# Altium project Eight_bit_v1.PrjPcb
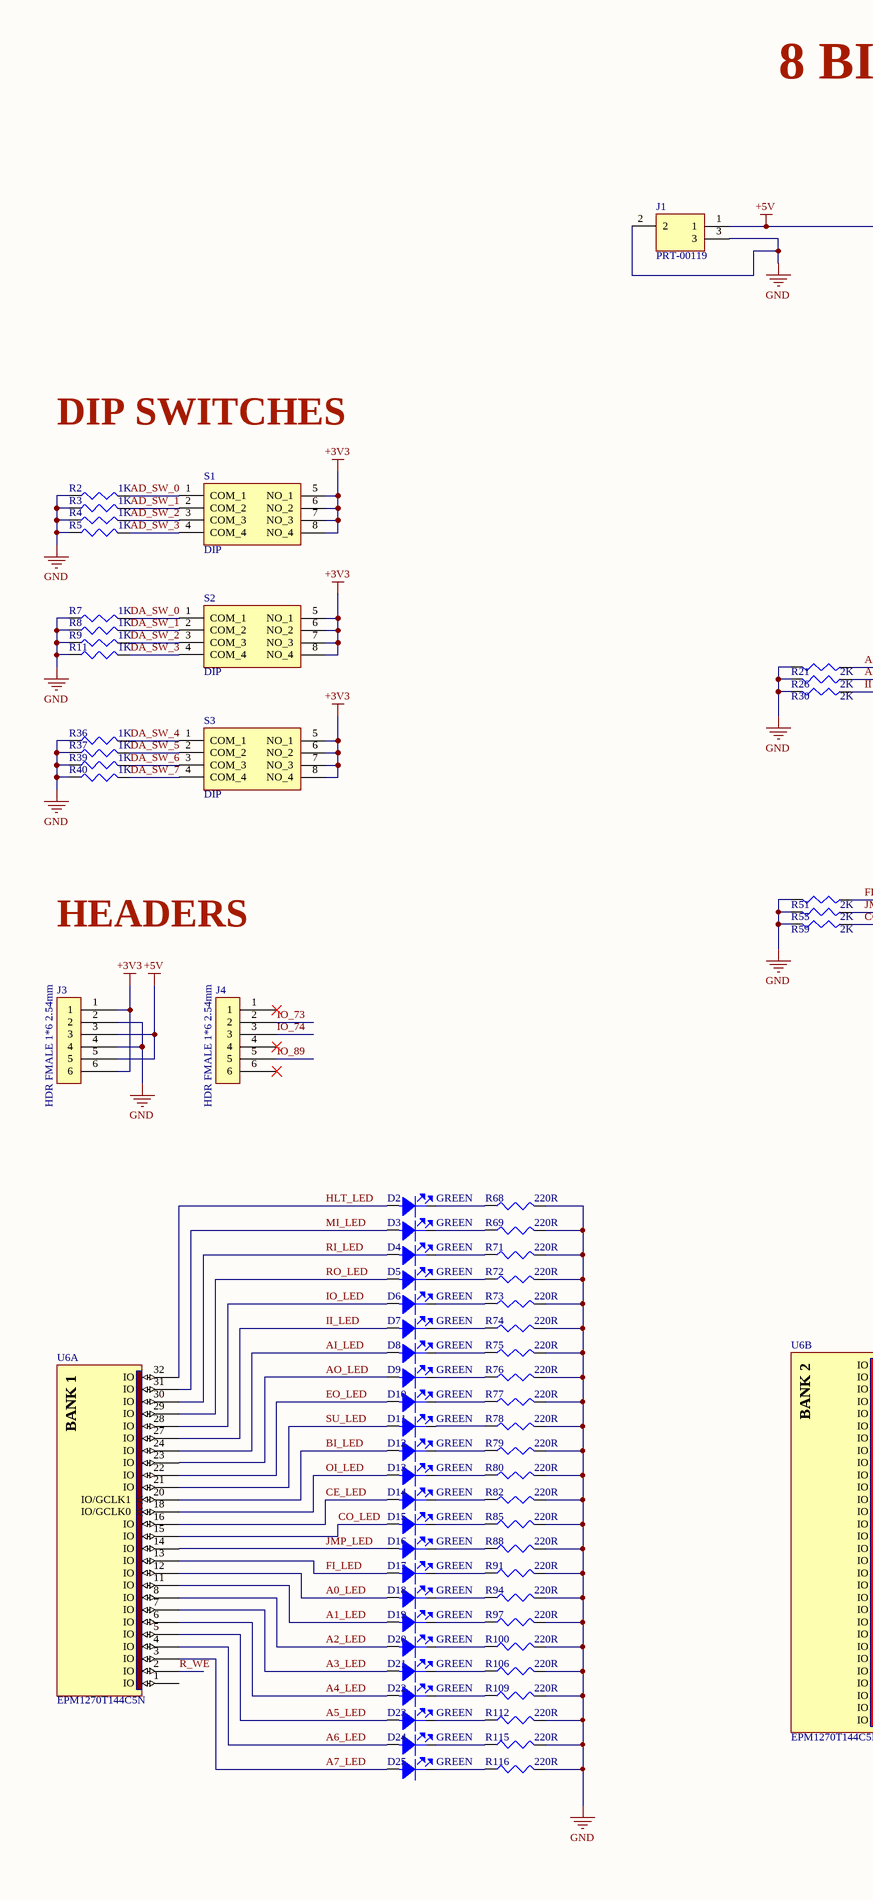
[diagram p0: Eight_bit_v1.SchDoc, left]
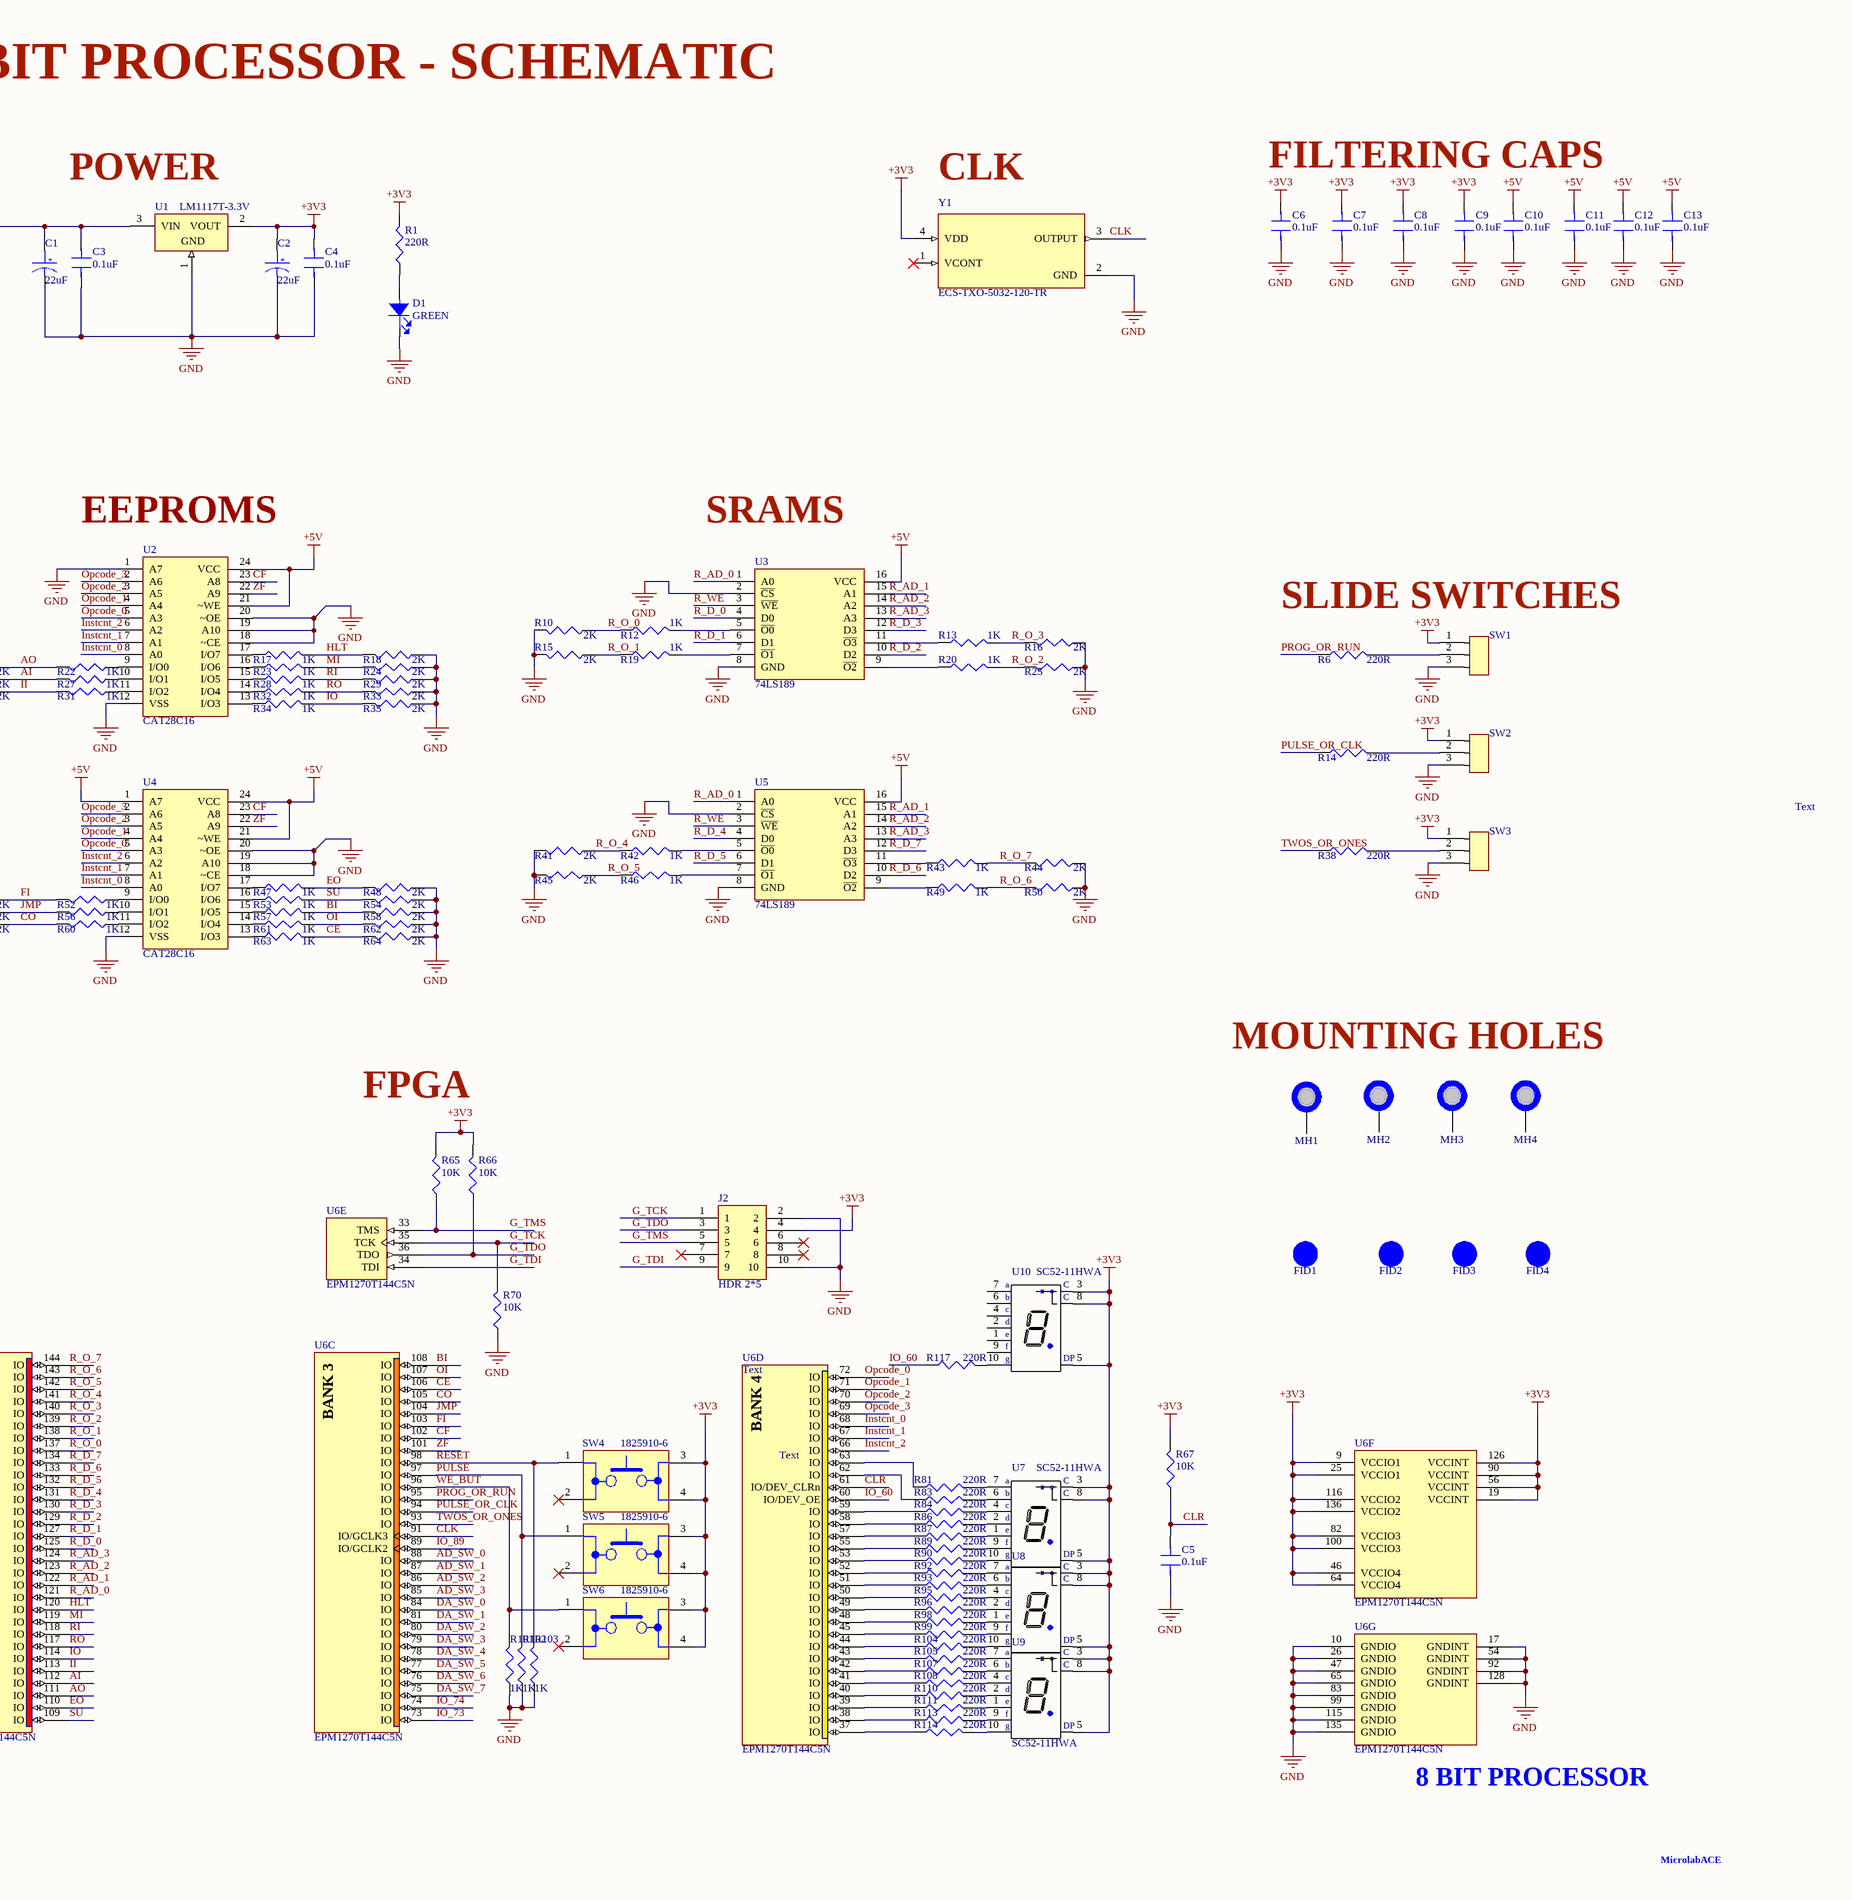
[diagram p1: Eight_bit_v1.SchDoc, right]
1 sheet, 187 parts. Net scope: global (net labels, ports and power ports of the same name join across sheets).
Board file: Eight_bit_v1.PcbDoc

## Sheet Eight_bit_v1.SchDoc
size A2

### Parts
C1  22uF  [CAPPRD200W50D550H1250]
C2  22uF  [CAPPRD200W50D550H1250]
C3  0.1uF  [C0805]
C4  0.1uF  [C0805]
C5  0.1uF  [C0805]
C6  0.1uF  [C0805]
C7  0.1uF  [C0805]
C8  0.1uF  [C0805]
C9  0.1uF  [C0805]
C10  0.1uF  [C0805]
C11  0.1uF  [C0805]
C12  0.1uF  [C0805]
C13  0.1uF  [C0805]
D1  GREEN  [LED_0805]
D2  GREEN  [LED_0805]
D3  GREEN  [LED_0805]
D4  GREEN  [LED_0805]
D5  GREEN  [LED_0805]
D6  GREEN  [LED_0805]
D7  GREEN  [LED_0805]
D8  GREEN  [LED_0805]
D9  GREEN  [LED_0805]
D10  GREEN  [LED_0805]
D11  GREEN  [LED_0805]
D12  GREEN  [LED_0805]
D13  GREEN  [LED_0805]
D14  GREEN  [LED_0805]
D15  GREEN  [LED_0805]
D16  GREEN  [LED_0805]
D17  GREEN  [LED_0805]
D18  GREEN  [LED_0805]
D19  GREEN  [LED_0805]
D20  GREEN  [LED_0805]
D21  GREEN  [LED_0805]
D22  GREEN  [LED_0805]
D23  GREEN  [LED_0805]
D24  GREEN  [LED_0805]
D25  GREEN  [LED_0805]
FID1  FID_1MMC  [FID_40x120D]  (value not drawn)  (no BOM)
FID2  FID_1MMC  [FID_40x120D]  (value not drawn)  (no BOM)
FID3  FID_1MMC  [FID_40x120D]  (value not drawn)  (no BOM)
FID4  FID_1MMC  [FID_40x120D]  (value not drawn)  (no BOM)
J1  PRT-00119  [PRT00119]
J2  HDR 2*5  [HDR_2X5_2.54MM]
J3  HDR FMALE 1*6 2.54mm  [Hdr_Female_1*6_2.54mm]
J4  HDR FMALE 1*6 2.54mm  [Hdr_Female_1*6_2.54mm]
MH1  MH_7.4MMNC_3.2MMD  [MH_7.4MMND_3.2MMD_NON_COPPER_NPTH]  (value not drawn)  (no BOM)
MH2  MH_7.4MMNC_3.2MMD  [MH_7.4MMND_3.2MMD_NON_COPPER_NPTH]  (value not drawn)  (no BOM)
MH3  MH_7.4MMNC_3.2MMD  [MH_7.4MMND_3.2MMD_NON_COPPER_NPTH]  (value not drawn)  (no BOM)
MH4  MH_7.4MMNC_3.2MMD  [MH_7.4MMND_3.2MMD_NON_COPPER_NPTH]  (value not drawn)  (no BOM)
R1  220R  [R0805]
R2  1K  [R0805]
R3  1K  [R0805]
R4  1K  [R0805]
R5  1K  [R0805]
R6  220R  [R0805]
R7  1K  [R0805]
R8  1K  [R0805]
R9  1K  [R0805]
R10  2K  [R0805]
R11  1K  [R0805]
R12  1K  [R0805]
R13  1K  [R0805]
R14  220R  [R0805]
R15  2K  [R0805]
R16  2K  [R0805]
R17  1K  [R0805]
R18  2K  [R0805]
R19  1K  [R0805]
R20  1K  [R0805]
R21  2K  [R0805]
R22  1K  [R0805]
R23  1K  [R0805]
R24  2K  [R0805]
R25  2K  [R0805]
R26  2K  [R0805]
R27  1K  [R0805]
R28  1K  [R0805]
R29  2K  [R0805]
R30  2K  [R0805]
R31  1K  [R0805]
R32  1K  [R0805]
R33  2K  [R0805]
R34  1K  [R0805]
R35  2K  [R0805]
R36  1K  [R0805]
R37  1K  [R0805]
R38  220R  [R0805]
R39  1K  [R0805]
R40  1K  [R0805]
R41  2K  [R0805]
R42  1K  [R0805]
R43  1K  [R0805]
R44  2K  [R0805]
R45  2K  [R0805]
R46  1K  [R0805]
R47  1K  [R0805]
R48  2K  [R0805]
R49  1K  [R0805]
R50  2K  [R0805]
R51  2K  [R0805]
R52  1K  [R0805]
R53  1K  [R0805]
R54  2K  [R0805]
R55  2K  [R0805]
R56  1K  [R0805]
R57  1K  [R0805]
R58  2K  [R0805]
R59  2K  [R0805]
R60  1K  [R0805]
R61  1K  [R0805]
R62  2K  [R0805]
R63  1K  [R0805]
R64  2K  [R0805]
R65  10K  [R0805]
R66  10K  [R0805]
R67  10K  [R0805]
R68  220R  [R0805]
R69  220R  [R0805]
R70  10K  [R0805]
R71  220R  [R0805]
R72  220R  [R0805]
R73  220R  [R0805]
R74  220R  [R0805]
R75  220R  [R0805]
R76  220R  [R0805]
R77  220R  [R0805]
R78  220R  [R0805]
R79  220R  [R0805]
R80  220R  [R0805]
R81  220R  [R0805]
R82  220R  [R0805]
R83  220R  [R0805]
R84  220R  [R0805]
R85  220R  [R0805]
R86  220R  [R0805]
R87  220R  [R0805]
R88  220R  [R0805]
R89  220R  [R0805]
R90  220R  [R0805]
R91  220R  [R0805]
R92  220R  [R0805]
R93  220R  [R0805]
R94  220R  [R0805]
R95  220R  [R0805]
R96  220R  [R0805]
R97  220R  [R0805]
R98  220R  [R0805]
R99  220R  [R0805]
R100  220R  [R0805]
R101  1K  [R0805]
R102  1K  [R0805]
R103  1K  [R0805]
R104  220R  [R0805]
R105  220R  [R0805]
R106  220R  [R0805]
R107  220R  [R0805]
R108  220R  [R0805]
R109  220R  [R0805]
R110  220R  [R0805]
R111  220R  [R0805]
R112  220R  [R0805]
R113  220R  [R0805]
R114  220R  [R0805]
R115  220R  [R0805]
R116  220R  [R0805]
R117  220R  [R0805]
S1  DIP  [BDB04]
S2  DIP  [BDB04]
S3  DIP  [BDB04]
SW1  1825159-1  [*SW_1825159-1]  (value not drawn)
SW2  1825159-1  [*SW_1825159-1]  (value not drawn)
SW3  1825159-1  [*SW_1825159-1]  (value not drawn)
SW4  1825910-6  [1825910-6]
SW5  1825910-6  [1825910-6]
SW6  1825910-6  [1825910-6]
U1  LM1117T-3.3V  [KC03]
U2  CAT28C16  [DIP254P1524X635-24]
U3  74LS189  [DIP762W60P254L1975H445Q16N]
U4  CAT28C16  [DIP254P1524X635-24]
U5  74LS189  [DIP762W60P254L1975H445Q16N]
U6  EPM1270T144C5N  [TQFP144_M]  (parts A,B,C,D,E,F,G of 7)
U7  SC52-11HWA  [*LED_SC52-11HWA]
U8  SC52-11HWA  [*LED_SC52-11HWA]  (value not drawn)
U9  SC52-11HWA  [*LED_SC52-11HWA]
U10  SC52-11HWA  [*LED_SC52-11HWA]
Y1  ECS-TXO-5032-120-TR  [*OSC_ECS-TXO-5032-120-TR]

### Nets
+3V3: C2.1 C4.2 C6.2 C7.2 C8.2 C9.2 J2.4 J3.1 J3.6 R1.2 R65.2 R66.2 R67.2 S1.5(NO_1) S1.6(NO_2) S1.7(NO_3) S1.8(NO_4) S2.5(NO_1) S2.6(NO_2) S2.7(NO_3) S2.8(NO_4) S3.5(NO_1) S3.6(NO_2) S3.7(NO_3) S3.8(NO_4) SW1.1 SW2.1 SW3.1 SW4.3 SW4.4 SW5.3 SW5.4 SW6.3 SW6.4 U1.2(VOUT) U6.9(VCCIO1) U6.19(VCCINT) U6.25(VCCIO1) U6.46(VCCIO4) U6.56(VCCINT) U6.64(VCCIO4) U6.82(VCCIO3) U6.90(VCCINT) U6.100(VCCIO3) U6.116(VCCIO2) U6.126(VCCINT) U6.136(VCCIO2) U7.3(C@1) U7.5(DP) U7.8(C@2) U8.3(C@1) U8.5(DP) U8.8(C@2) U9.3(C@1) U9.5(DP) U9.8(C@2) U10.3(C@1) U10.5(DP) U10.8(C@2) Y1.4(VDD)
+5V: C1.1 C3.2 C10.2 C11.2 C12.2 C13.2 J1.1 J3.3 J3.5 U1.3(VIN) U2.21(~WE) U2.24(VCC) U3.16(VCC) U4.1(A7) U4.21(~WE) U4.24(VCC) U5.16(VCC)
GND: C1.2 C2.2 C3.1 C4.1 C5.1 C6.1 C7.1 C8.1 C9.1 C10.1 C11.1 C12.1 C13.1 D1.1(Cathode) J1.2 J1.3 J2.2 J2.10 J3.2 J3.4 R2.1 R3.1 R4.1 R5.1 R7.1 R8.1 R9.1 R10.2 R11.1 R15.2 R16.1 R18.1 R21.2 R24.1 R25.1 R26.2 R29.1 R30.2 R33.1 R35.1 R36.1 R37.1 R39.1 R40.1 R41.2 R44.1 R45.2 R48.1 R50.1 R51.2 R54.1 R55.2 R58.1 R59.2 R62.1 R64.1 R68.2 R69.2 R70.1 R71.2 R72.2 R73.2 R74.2 R75.2 R76.2 R77.2 R78.2 R79.2 R80.2 R82.2 R85.2 R88.2 R91.2 R94.2 R97.2 R100.2 R101.1 R102.1 R103.1 R106.2 R109.2 R112.2 R115.2 R116.2 SW1.3 SW2.3 SW3.3 U1.1(GND) U2.1(A7) U2.12(VSS) U2.18(~CE) U2.19(A10) U2.20(~OE) U3.2(~{CS}) U3.8(GND) U4.12(VSS) U4.18(~CE) U4.19(A10) U4.20(~OE) U5.2(~{CS}) U5.8(GND) U6.10(GNDIO) U6.17(GNDINT) U6.26(GNDIO) U6.47(GNDIO) U6.54(GNDINT) U6.65(GNDIO) U6.83(GNDIO) U6.92(GNDINT) U6.99(GNDIO) U6.115(GNDIO) U6.128(GNDINT) U6.135(GNDIO) Y1.2(GND)
A0_LED: D18.2(Anode) U6.12(IO)
A1_LED: D19.2(Anode) U6.11(IO)
A2_LED: D20.2(Anode) U6.8(IO)
A3_LED: D21.2(Anode) U6.7(IO)
A4_LED: D22.2(Anode) U6.6(IO)
A5_LED: D23.2(Anode) U6.5(IO)
A6_LED: D24.2(Anode) U6.4(IO)
A7_LED: D25.2(Anode) U6.3(IO)
AD_SW_0: R2.2 S1.1(COM_1) U6.88(IO)
AD_SW_1: R3.2 S1.2(COM_2) U6.87(IO)
AD_SW_2: R4.2 S1.3(COM_3) U6.86(IO)
AD_SW_3: R5.2 S1.4(COM_4) U6.85(IO)
AI: R26.1 R27.2 U6.112(IO)
AI_LED: D8.2(Anode) U6.24(IO)
AO: R21.1 R22.2 U6.111(IO)
AO_LED: D9.2(Anode) U6.23(IO)
BI: R57.2 R58.2 U6.108(IO)
BI_LED: D12.2(Anode) U6.20(IO/GCLK1)
CE: R63.2 R64.2 U6.106(IO)
CE_LED: D14.2(Anode) U6.16(IO)
CF: U2.23(A8) U4.23(A8) U6.102(IO)
CLK: U6.91(IO/GCLK3) Y1.3(OUTPUT)
CLR: C5.2 R67.1 U6.61(IO/DEV_CLRn)
CO: R59.1 R60.2 U6.105(IO)
CO_LED: D15.2(Anode) U6.15(IO)
DA_SW_0: R7.2 S2.1(COM_1) U6.84(IO)
DA_SW_1: R8.2 S2.2(COM_2) U6.81(IO)
DA_SW_2: R9.2 S2.3(COM_3) U6.80(IO)
DA_SW_3: R11.2 S2.4(COM_4) U6.79(IO)
DA_SW_4: R36.2 S3.1(COM_1) U6.78(IO)
DA_SW_5: R37.2 S3.2(COM_2) U6.77(IO)
DA_SW_6: R39.2 S3.3(COM_3) U6.76(IO)
DA_SW_7: R40.2 S3.4(COM_4) U6.75(IO)
EO: R47.2 R48.2 U6.110(IO)
EO_LED: D10.2(Anode) U6.22(IO)
FI: R51.1 R52.2 U6.103(IO)
FI_LED: D17.2(Anode) U6.13(IO)
G_TCK: J2.1 R70.2 U6.35(TCK)
G_TDI: J2.9 U6.34(TDI)
G_TDO: J2.3 R66.1 U6.36(TDO)
G_TMS: J2.5 R65.1 U6.33(TMS)
HLT: R17.2 R18.2 U6.120(IO)
HLT_LED: D2.2(Anode) U6.32(IO)
II: R30.1 R31.2 U6.113(IO)
II_LED: D7.2(Anode) U6.27(IO)
Instcnt_0: U2.8(A0) U4.8(A0) U6.68(IO)
Instcnt_1: U2.7(A1) U4.7(A1) U6.67(IO)
Instcnt_2: U2.6(A2) U4.6(A2) U6.66(IO)
IO: R34.2 R35.2 U6.114(IO)
IO_60: R117.1 U6.60(IO/DEV_OE)
IO_73: J4.2 U6.73(IO)
IO_74: J4.3 U6.74(IO)
IO_89: J4.5 U6.89(IO/GCLK2)
IO_LED: D6.2(Anode) U6.28(IO)
JMP: R55.1 R56.2 U6.104(IO)
JMP_LED: D16.2(Anode) U6.14(IO)
MI: R23.2 R24.2 U6.119(IO)
MI_LED: D3.2(Anode) U6.31(IO)
OI: R61.2 R62.2 U6.107(IO)
OI_LED: D13.2(Anode) U6.18(IO/GCLK0)
Opcode_0: U2.5(A3) U4.5(A3) U6.72(IO)
Opcode_1: U2.4(A4) U4.4(A4) U6.71(IO)
Opcode_2: U2.3(A5) U4.3(A5) U6.70(IO)
Opcode_3: U2.2(A6) U4.2(A6) U6.69(IO)
PROG_OR_RUN: R6.1 U6.95(IO)
PULSE: R102.2 SW5.1 U6.97(IO)
PULSE_OR_CLK: R14.1 U6.94(IO)
R_AD_0: U3.1(A0) U5.1(A0) U6.121(IO)
R_AD_1: U3.15(A1) U5.15(A1) U6.122(IO)
R_AD_2: U3.14(A2) U5.14(A2) U6.123(IO)
R_AD_3: U3.13(A3) U5.13(A3) U6.124(IO)
R_D_0: U3.4(D0) U6.125(IO)
R_D_1: U3.6(D1) U6.127(IO)
R_D_2: U3.10(D2) U6.129(IO)
R_D_3: U3.12(D3) U6.130(IO)
R_D_4: U5.4(D0) U6.131(IO)
R_D_5: U5.6(D1) U6.132(IO)
R_D_6: U5.10(D2) U6.133(IO)
R_D_7: U5.12(D3) U6.134(IO)
R_O_0: R10.1 R12.1 U6.137(IO)
R_O_1: R15.1 R19.1 U6.138(IO)
R_O_2: R20.2 R25.2 U6.139(IO)
R_O_3: R13.2 R16.2 U6.140(IO)
R_O_4: R41.1 R42.1 U6.141(IO)
R_O_5: R45.1 R46.1 U6.142(IO)
R_O_6: R49.2 R50.2 U6.143(IO)
R_O_7: R43.2 R44.2 U6.144(IO)
R_WE: U3.3(~{WE}) U5.3(~{WE}) U6.2(IO)
RESET: R103.2 SW4.1 U6.98(IO)
RI: R28.2 R29.2 U6.118(IO)
RI_LED: D4.2(Anode) U6.30(IO)
RO: R32.2 R33.2 U6.117(IO)
RO_LED: D5.2(Anode) U6.29(IO)
SU: R53.2 R54.2 U6.109(IO)
SU_LED: D11.2(Anode) U6.21(IO)
TWOS_OR_ONES: R38.1 U6.93(IO)
WE_BUT: R101.2 SW6.1 U6.96(IO)
ZF: U2.22(A9) U4.22(A9) U6.101(IO)
NetD1_2: D1.2(Anode) R1.1
NetD2_1: D2.1(Cathode) R68.1
NetD3_1: D3.1(Cathode) R69.1
NetD4_1: D4.1(Cathode) R71.1
NetD5_1: D5.1(Cathode) R72.1
NetD6_1: D6.1(Cathode) R73.1
NetD7_1: D7.1(Cathode) R74.1
NetD8_1: D8.1(Cathode) R75.1
NetD9_1: D9.1(Cathode) R76.1
NetD10_1: D10.1(Cathode) R77.1
NetD11_1: D11.1(Cathode) R78.1
NetD12_1: D12.1(Cathode) R79.1
NetD13_1: D13.1(Cathode) R80.1
NetD14_1: D14.1(Cathode) R82.1
NetD15_1: D15.1(Cathode) R85.1
NetD16_1: D16.1(Cathode) R88.1
NetD17_1: D17.1(Cathode) R91.1
NetD18_1: D18.1(Cathode) R94.1
NetD19_1: D19.1(Cathode) R97.1
NetD20_1: D20.1(Cathode) R100.1
NetD21_1: D21.1(Cathode) R106.1
NetD22_1: D22.1(Cathode) R109.1
NetD23_1: D23.1(Cathode) R112.1
NetD24_1: D24.1(Cathode) R115.1
NetD25_1: D25.1(Cathode) R116.1
NetR6_2: R6.2 SW1.2
NetR12_2: R12.2 U3.5(~{O0})
NetR13_1: R13.1 U3.11(~{O3})
NetR14_2: R14.2 SW2.2
NetR17_1: R17.1 U2.17(I/O7)
NetR19_2: R19.2 U3.7(~{O1})
NetR20_1: R20.1 U3.9(~{O2})
NetR22_1: R22.1 U2.9(I/O0)
NetR23_1: R23.1 U2.16(I/O6)
NetR27_1: R27.1 U2.10(I/O1)
NetR28_1: R28.1 U2.15(I/O5)
NetR31_1: R31.1 U2.11(I/O2)
NetR32_1: R32.1 U2.14(I/O4)
NetR34_1: R34.1 U2.13(I/O3)
NetR38_2: R38.2 SW3.2
NetR42_2: R42.2 U5.5(~{O0})
NetR43_1: R43.1 U5.11(~{O3})
NetR46_2: R46.2 U5.7(~{O1})
NetR47_1: R47.1 U4.17(I/O7)
NetR49_1: R49.1 U5.9(~{O2})
NetR52_1: R52.1 U4.9(I/O0)
NetR53_1: R53.1 U4.16(I/O6)
NetR56_1: R56.1 U4.10(I/O1)
NetR57_1: R57.1 U4.15(I/O5)
NetR60_1: R60.1 U4.11(I/O2)
NetR61_1: R61.1 U4.14(I/O4)
NetR63_1: R63.1 U4.13(I/O3)
NetR81_1: R81.1 U6.63(IO)
NetR81_2: R81.2 U7.7(A)
NetR83_1: R83.1 U6.62(IO)
NetR83_2: R83.2 U7.6(B)
NetR84_1: R84.1 U6.59(IO)
NetR84_2: R84.2 U7.4(C)
NetR86_1: R86.1 U6.58(IO)
NetR86_2: R86.2 U7.2(D)
NetR87_1: R87.1 U6.57(IO)
NetR87_2: R87.2 U7.1(E)
NetR89_1: R89.1 U6.55(IO)
NetR89_2: R89.2 U7.9(F)
NetR90_1: R90.1 U6.53(IO)
NetR90_2: R90.2 U7.10(G)
NetR92_1: R92.1 U6.52(IO)
NetR92_2: R92.2 U8.7(A)
NetR93_1: R93.1 U6.51(IO)
NetR93_2: R93.2 U8.6(B)
NetR95_1: R95.1 U6.50(IO)
NetR95_2: R95.2 U8.4(C)
NetR96_1: R96.1 U6.49(IO)
NetR96_2: R96.2 U8.2(D)
NetR98_1: R98.1 U6.48(IO)
NetR98_2: R98.2 U8.1(E)
NetR99_1: R99.1 U6.45(IO)
NetR99_2: R99.2 U8.9(F)
NetR104_1: R104.1 U6.44(IO)
NetR104_2: R104.2 U8.10(G)
NetR105_1: R105.1 U6.43(IO)
NetR105_2: R105.2 U9.7(A)
NetR107_1: R107.1 U6.42(IO)
NetR107_2: R107.2 U9.6(B)
NetR108_1: R108.1 U6.41(IO)
NetR108_2: R108.2 U9.4(C)
NetR110_1: R110.1 U6.40(IO)
NetR110_2: R110.2 U9.2(D)
NetR111_1: R111.1 U6.39(IO)
NetR111_2: R111.2 U9.1(E)
NetR113_1: R113.1 U6.38(IO)
NetR113_2: R113.2 U9.9(F)
NetR114_1: R114.1 U6.37(IO)
NetR114_2: R114.2 U9.10(G)
NetR117_2: R117.2 U10.10(G)

Not connected (* = marked no-connect by the designer): J2 6* 7* 8*; J4 1* 4* 6*; MH1 1; MH2 1; MH3 1; MH4 1; SW4 2*; SW5 2*; SW6 2*; U6 1(IO); U10 1(E) 2(D) 4(C) 6(B) 7(A) 9(F); Y1 1(VCONT)*

### Notes on the sheet
- 8 BIT PROCESSOR - SCHEMATIC
- (near U1) POWER
- CLK
- FILTERING CAPS
- DIP SWITCHES
- (near U2) EEPROMS
- SRAMS
- SLIDE SWITCHES
- Text
- HEADERS
- MOUNTING HOLES
- FPGA
- (near U6) Text
- (near U6) 8 BIT PROCESSOR
- MicrolabACE
- (in symbol ECA-1EM220I) +
- (in symbol EPM1270T144C5N, part A) BANK 1
- (in symbol EPM1270T144C5N, part B) BANK 2
- (in symbol EPM1270T144C5N, part C) BANK 3
- (in symbol EPM1270T144C5N, part D) BANK 4
- (in symbol SC52-11HWA) a; b; c; d; e; f; g

### Library data of the parts
C1 C2 = ECA-1EM220I: Cap Aluminum 22uF 25V 20% Radial 2000 hr 85C Ammo Pack; Manufacturer: Panasonic; Ripple Current: 90mA; Polarity: Polar; Life (Hours): 2000Hour; Lead/Base Style: Straight; Supplier 1: Digi-Key; Manufacturer Part Number: ECA-1EM220I; Stock 1: 8543; Pricing 1: 1=0.22, 10=0.147, 100=0.0743, 500=0.05084, 1000=0.04497 (USD); Mount: Through Hole; Case/Package: Radial; Contact Plating: Tin; Min Operating Temperature: -40°C; Max Operating Temperature: 85°C; Capacitance: 22uF; Voltage Rating: 25V; Tolerance: 20%; Packaging: Tape and Reel; Package Quantity: 2000; Voltage Rating (DC): 25V; Termination: Radial; Diameter: 5mm; Length: 11mm; Lead Pitch: 0.098inch; Height - Seated (Max): 0.472inch; ComponentLink1URL: http://media.digikey.com/pdf/Data%20Sheets/Panasonic%20Capacitors%20PDFs/ECA-xxM%20Spec.pdf?src-supplier=Digi-Key; ComponentLink1Description: http://media.digikey.com/pdf/Data%20Sheets/Panasonic%20Capacitors%20PDFs/ECA-xxM%20Spec.pdf?src-supplier=Digi-Key; Supplier Part Number 1: P19523CT-ND
C3-C13 = C0805C104K5RACTU: Cap Ceramic 0.1uF 50V X7R 10% SMD 2.0 x 1.2 mm 125 C Paper T/R; Manufacturer: KEMET; Capacitance: 100nF; Voltage: 500V; Supplier 1: Digi-Key; Manufacturer Part Number: C0805C104K5RACTU; Stock 1: 466047; Pricing 1: 1=0.21, 10=0.152, 100=0.0715, 500=0.05016, 1000=0.04152 (USD); Mount: Surface Mount,PCB; Case/Package: 0805; Number of Pins: 2; Case Code (Imperial): 0805; Case Code (Metric): 2012; Contact Plating: Tin,Matte; Dielectric Material: Ceramic; Min Operating Temperature: -55°C; Max Operating Temperature: 125°C; Tolerance: 10%; Dielectric: X7R; Package Quantity: 4000; Voltage Rating: 50V; Packaging: Tape and Reel; Voltage Rating (DC): 50V; Termination: SMD/SMT; Length: 2mm; Height: 0.9mm; Depth: 1.25mm; Width: 1.2mm; Lead Pitch: 0.75mm; Thickness: 0.035inch; Radiation Hardening: No; REACH SVHC: No SVHC; ComponentLink1URL: http://www.alliedelec.com/m/d/9bfe7773041ffe9d406e68bc7b377fdd.pdf?src-supplier=Allied+Electronics; ComponentLink1Description: http://www.alliedelec.com/m/d/9bfe7773041ffe9d406e68bc7b377fdd.pdf?src-supplier=Allied+Electronics; ComponentLink2URL: http://www.farnell.com/datasheets/2740684.pdf?src-supplier=Element14; ComponentLink2Description: http://www.farnell.com/datasheets/2740684.pdf?src-supplier=Element14; ComponentLink3URL: https://www.distrelec.biz/Web/Downloads/_t/ds/KEM_C1002_X7R_SMD_eng_tds.pdf?mime=application%2Fpdf&src-supplier=Distrelec; ComponentLink3Description: https://www.distrelec.biz/Web/Downloads/_t/ds/KEM_C1002_X7R_SMD_eng_tds.pdf?mime=application%2Fpdf&src-supplier=Distrelec; Supplier Part Number 1: 399-1170-6-ND
D1-D25 = LGR971-KN-1: LED Uni-Color Green 572nm 2-Pin SMD T/R; Manufacturer: Osram Opto; Lens Color: White; Forward Current: 25mA; Forward Voltage: 2.2V; Lens Style: Diffused,Flat,Colorless,Rectangular; Luminous Intensity: 45mcd; Viewing Angle: 160°; Test Current: 20mA; Dominant Wavelength: 570nm; Lens Transparency: Diffused; Luminous Flux: 0.1lm; Number of Elements: 1; Power Dissipation: 65mW; Reverse Voltage: 12V; Lens Size: 1.25mm; Supplier 1: Digi-Key; Manufacturer Part Number: LGR971-KN-1; Stock 1: 297791; Pricing 1: 1=0.31, 10=0.229, 100=0.1083, 500=0.07222, 1000=0.05656 (USD); Mount: Surface Mount; Case/Package: 0805; Number of Pins: 2; Color: Green; Case Code (Metric): 2012; Case Code (Imperial): 0805; Min Operating Temperature: -30°C; Max Operating Temperature: 85°C; Packaging: Tape and Reel; Package Quantity: 1; Illumination Color: Green; Number of LEDs: 1; Length: 2.1mm; Height: 0.9mm; Width: 1.25mm; Depth: 1.35mm; Radiation Hardening: No; ComponentLink1URL: https://www.verical.com/server-webapp/html/getDatasheet?partID=233880&src-supplier=Verical; ComponentLink1Description: https://www.verical.com/server-webapp/html/getDatasheet?partID=233880&src-supplier=Verical; ComponentLink2URL: https://www.verical.com/server-webapp/html/getDatasheet?partID=462214&src-supplier=Verical; ComponentLink2Description: https://www.verical.com/server-webapp/html/getDatasheet?partID=462214&src-supplier=Verical; ComponentLink3URL: https://dammedia.osram.info/media/resource/hires/osram-dam-2493936/LG%20R971.pdf?src-supplier=Digi-Key; ComponentLink3Description: https://dammedia.osram.info/media/resource/hires/osram-dam-2493936/LG%20R971.pdf?src-supplier=Digi-Key; ComponentLink4URL: http://www.mouser.com/ds/2/311/LG%20R971%20-%20CHIPLED%200805-318376.pdf?src-supplier=Mouser; ComponentLink4Description: http://www.mouser.com/ds/2/311/LG%20R971%20-%20CHIPLED%200805-318376.pdf?src-supplier=Mouser; Supplier Part Number 1: 475-1410-6-ND
FID1-FID4 = FID_1MMC: Fiducial 40mil Diameter 120mil Mask
J1 = PRT-00119: Connector; Manufacturer_Name: SparkFun; Datasheet Link: https://www.sparkfun.com/datasheets/Prototyping/Barrel-Connector-PJ-202A.pdf; Height: 11mm; Manufacturer_Part_Number: PRT-00119; Mouser Part Number: 474-PRT-00119; Mouser Price/Stock: https://www.mouser.com/Search/Refine.aspx?Keyword=474-PRT-00119
J2 = 67997-110HLF: CONN HEADER 10POS .100 STR 30AU; Manufacturer: Amphenol FCI; Current Rating: 3A; Voltage Rating: 1.5kV; Number of Positions: 10; Insulation Resistance: 5GR; Gender: Male; Connector Type: Male Pin; Pitch: 2.54mm; Contact Post Length: 3.05mm; Row Spacing: 0.1inch; Supplier 1: Digi-Key; Manufacturer Part Number: 67997-110HLF; Stock 1: 584; Pricing 1: 1=2.66, 10=2.412, 100=2.067, 500=1.72252, 1000=1.47645, 5000=1.30912 (USD); Mount: Through Hole; Contact Plating: Gold,GXT; Contact Material: Bronze; Color: Black; Housing Color: Black; Housing Material: Thermoplastic; Min Operating Temperature: -65°C; Max Operating Temperature: 125°C; Number of Rows: 2; Contact Gender: Male; Packaging: Bulk; Package Quantity: 100; Termination: Solder; Max Voltage Rating (AC): 1.5kV; Number of Contacts: 10; Orientation: Straight; Length: 12.7mm; Contact Mating Length: 0.23inch; Depth: 4.83mm; REACH SVHC: No SVHC; Lead Free: Lead Free; Flammability Rating: UL94 V-0; ComponentLink1URL: http://www.mouser.com/ds/2/154/67996-225308.pdf?src-supplier=Mouser; ComponentLink1Description: http://www.mouser.com/ds/2/154/67996-225308.pdf?src-supplier=Mouser; ComponentLink2URL: https://cdn.amphenol-icc.com/media/wysiwyg/files/drawing/67996.pdf?src-supplier=Digi-Key; ComponentLink2Description: https://cdn.amphenol-icc.com/media/wysiwyg/files/drawing/67996.pdf?src-supplier=Digi-Key; ComponentLink3URL: http://portal.fciconnect.com/Comergent/fci/drawing/67996.pdf?src-supplier=Avnet; ComponentLink3Description: http://portal.fciconnect.com/Comergent/fci/drawing/67996.pdf?src-supplier=Avnet; ComponentLink4URL: http://www.farnell.com/datasheets/1876884.pdf?src-supplier=Element14; ComponentLink4Description: http://www.farnell.com/datasheets/1876884.pdf?src-supplier=Element14; Supplier Part Number 1: 609-3394-ND
J3 J4 = M20-7820646: 06-WAY SIL VERT SOCKET L/FREE; Manufacturer: Harwin; Number of Contacts: 6; Max Current Rating: 3A; Contact Resistance: 20mR; Connector Type: Receptacle,Socket; Gender: Female; Supplier 1: Digi-Key; Manufacturer Part Number: M20-7820646; Stock 1: 2187; Pricing 1: 1=0.96, 36=0.79194, 108=0.72602, 504=0.59401, 1008=0.528, 5004=0.462, 10008=0.4389 (USD); Mount: Through Hole; Case/Package: SIL; Color: Black; Contact Plating: Tin; Contact Material: Bronze; Housing Color: Black; Housing Material: Nylon; Min Operating Temperature: -40°C; Max Operating Temperature: 105°C; Number of Rows: 1; Termination: Solder; Packaging: Rail/Tube; Contact Gender: Female; Package Quantity: 38; Number of Positions: 6; Orientation: Straight; Length: 15.64mm; Pitch: 2.54mm; Depth: 2.5mm; Radiation Hardening: No; Supplier Part Number 1: 952-1809-ND
MH1-MH4 = MH_7.4MMNC_3.2MMD: Mounting Hole 7.4mm Diameter (Non Copper), 3.2mm Drill NPTH
R1 R6 R14 R38 R68 R69 R71-R100 R104-R117 = RC0805FR-07220RL: RES SMD 220 OHM 1% 1/8W 0805; Manufacturer: Yageo; Power Rating: 125mW; Voltage Rating: 150V; Temperature Coefficient: 100ppm/°C; Supplier 1: Digi-Key; Manufacturer Part Number: RC0805FR-07220RL; Stock 1: 1577155; Pricing 1: 1=0.1, 10=0.042, 100=0.017, 1000=0.00762, 2500=0.00662 (USD); Case/Package: 0805; Case Code (Metric): 2012; Case Code (Imperial): 0805; Min Operating Temperature: -55°C; Max Operating Temperature: 155°C; Composition: Thick Film; Tolerance: 1%; Resistance: 220R; Packaging: Tape and Reel; Package Quantity: 5000; Number of Terminations: 2; Termination: SMD/SMT; Military Standard: Not; Max Power Dissipation: 125mW; Features: Moisture Resistant; Length: 2mm; Height: 0.5mm; Width: 0.049inch; Depth: 1.25mm; REACH SVHC: Unknown; Lead Free: Lead Free; ComponentLink1URL: http://www.yageo.com/documents/recent/PYu-RC_Group_51_RoHS_L_10.pdf?src-supplier=Digi-Key; ComponentLink1Description: http://www.yageo.com/documents/recent/PYu-RC_Group_51_RoHS_L_10.pdf?src-supplier=Digi-Key; ComponentLink2URL: http://www.yageo.com/documents/recent/PYu-RC_Group_51_RoHS_L_9.pdf?src-supplier=Digi-Key; ComponentLink2Description: http://www.yageo.com/documents/recent/PYu-RC_Group_51_RoHS_L_9.pdf?src-supplier=Digi-Key; ComponentLink3URL: http://www.farnell.com/datasheets/2167052.pdf?src-supplier=Element14; ComponentLink3Description: http://www.farnell.com/datasheets/2167052.pdf?src-supplier=Element14; Supplier Part Number 1: 311-220CRDKR-ND
R2-R5 R7-R9 R11-R13 R17 R19 R20 R22 R23 R27 R28 R31 R32 R34 R36 R37 R39 R40 R42 R43 R46 R47 R49 R52 R53 R56 R57 R60 R61 R63 R101-R103 = RC0805FR-071KL: RES SMD 1K OHM 1% 1/8W 0805; Manufacturer: Yageo Phycomp; Temperature Coefficient: 100ppm/°C; Resistance: 1000R; Voltage Rating (DC): 150V; Power Rating: 125mW; Supplier 1: Digi-Key; Manufacturer Part Number: RC0805FR-071KL; Stock 1: 27085000; Pricing 1: 5000=0.00497, 10000=0.00431, 25000=0.00379, 50000=0.00348, 125000=0.00341 (USD); Mount: Surface Mount; Case/Package: 0805; Number of Pins: 2; Min Operating Temperature: -55°C; Max Operating Temperature: 155°C; Tolerance: 1%; Packaging: Cut Tape; Length: 2mm; Height: 0.5mm; Width: 1.25mm; Depth: 1.25mm; REACH SVHC: No SVHC; Lead Free: Lead Free; Supplier Part Number 1: 311-1.00KCRTR-ND
R10 R15 R16 R18 R21 R24-R26 R29 R30 R33 R35 R41 R44 R45 R48 R50 R51 R54 R55 R58 R59 R62 R64 = RC0805FR-072KL: RES SMD 2K OHM 1% 1/8W 0805; Manufacturer: Yageo; Resistance: 2kR; Temperature Coefficient: 100ppm/°C; Voltage Rating (DC): 150V; Power Rating: 125mW; Supplier 1: Digi-Key; Manufacturer Part Number: RC0805FR-072KL; Stock 1: 4153369; Pricing 1: 1=0.1, 10=0.042, 100=0.017, 1000=0.00762, 2500=0.00662 (USD); Case/Package: 0805; Number of Pins: 2; Case Code (Metric): 2012; Case Code (Imperial): 0805; Min Operating Temperature: -55°C; Max Operating Temperature: 155°C; Tolerance: 1%; Composition: Thick Film; Packaging: Tape and Reel; Voltage Rating: 150V; Package Quantity: 1; Number of Terminations: 2; Termination: SMD/SMT; Military Standard: Not; Max Power Dissipation: 125mW; Working Voltage: 150V; Features: Moisture Resistant; Length: 2mm; Height: 0.024inch; Width: 0.049inch; Depth: 1.25mm; Lead Free: Lead Free; REACH SVHC: No SVHC; ComponentLink1URL: http://www.yageo.com/documents/recent/PYu-RC_Group_51_RoHS_L_10.pdf?src-supplier=Digi-Key; ComponentLink1Description: http://www.yageo.com/documents/recent/PYu-RC_Group_51_RoHS_L_10.pdf?src-supplier=Digi-Key; ComponentLink2URL: http://www.yageo.com/documents/recent/PYu-RC_Group_51_RoHS_L_9.pdf?src-supplier=Digi-Key; ComponentLink2Description: http://www.yageo.com/documents/recent/PYu-RC_Group_51_RoHS_L_9.pdf?src-supplier=Digi-Key; ComponentLink3URL: http://documents.rs-components.com/techlib://itc_doclist_GB.htm?stockno=6182912&src-supplier=RSComponents; ComponentLink3Description: http://documents.rs-components.com/techlib://itc_doclist_GB.htm?stockno=6182912&src-supplier=RSComponents; ComponentLink4URL: http://www.farnell.com/datasheets/2167052.pdf?src-supplier=Element14; ComponentLink4Description: http://www.farnell.com/datasheets/2167052.pdf?src-supplier=Element14; ComponentLink5URL: http://www.mouser.com/ds/2/447/Yageo_08112016_RC0805-968729.pdf?src-supplier=Mouser; ComponentLink5Description: http://www.mouser.com/ds/2/447/Yageo_08112016_RC0805-968729.pdf?src-supplier=Mouser; Supplier Part Number 1: 311-2.00KCRDKR-ND
R65-R67 R70 = RC0805FR-0710KL: RES SMD 10K OHM 1% 1/8W 0805; Manufacturer: Yageo; Resistance: 10kR; Temperature Coefficient: 100ppm/°C; Power Rating: 125mW; Voltage Rating: 150V; Supplier 1: Digi-Key; Manufacturer Part Number: RC0805FR-0710KL; Stock 1: 39903968; Pricing 1: 1=0.1, 10=0.042, 100=0.017, 1000=0.00762, 2500=0.00662 (USD); Case/Package: 0805; Case Code (Imperial): 0805; Case Code (Metric): 2012; Min Operating Temperature: -55°C; Max Operating Temperature: 155°C; Tolerance: 1%; Composition: Thick Film; Packaging: Tape and Reel; Package Quantity: 1; Termination: SMD/SMT; Number of Terminations: 2; Military Standard: Not; Max Power Dissipation: 125mW; Features: Moisture Resistant; Length: 2mm; Height: 0.024inch; Width: 0.049inch; Depth: 1.25mm; REACH SVHC: Unknown; Lead Free: Lead Free; ComponentLink1URL: http://www.yageo.com/documents/recent/PYu-RC_Group_51_RoHS_L_9.pdf?src-supplier=Mouser; ComponentLink1Description: http://www.yageo.com/documents/recent/PYu-RC_Group_51_RoHS_L_9.pdf?src-supplier=Mouser; ComponentLink2URL: http://www.farnell.com/datasheets/2167052.pdf?src-supplier=Element14; ComponentLink2Description: http://www.farnell.com/datasheets/2167052.pdf?src-supplier=Element14; ComponentLink3URL: http://www.yageo.com/documents/recent/PYu-RC_Group_51_RoHS_L_10.pdf?src-supplier=Digi-Key; ComponentLink3Description: http://www.yageo.com/documents/recent/PYu-RC_Group_51_RoHS_L_10.pdf?src-supplier=Digi-Key; ComponentLink4URL: http://www.yageo.ru/pdf/RC0805.pdf?src-supplier=Future+Electronics; ComponentLink4Description: http://www.yageo.ru/pdf/RC0805.pdf?src-supplier=Future+Electronics; Supplier Part Number 1: 311-10.0KCRCT-ND
S1-S3 = BDB04: Switch; Manufacturer_Name: C & K COMPONENTS; Datasheet Link: https://componentsearchengine.com/Datasheets/2/BDB04.pdf; Height: 7.45mm; Manufacturer_Part_Number: BDB04; Mouser Part Number: 611-BDB04; Mouser Price/Stock: https://www.mouser.com/Search/Refine.aspx?Keyword=611-BDB04
SW1-SW3 = 1825159-1: STS121PC04=SPDT SLIDE SWITCH; Configuration_Pole-Throw: Single Pole - Double Throw; Contact_Current_Rating: .25 A; MF: TE Connectivity; Price: None; MP: 1825159-1; Package: None; Availability: Unavailable; TE_purchase_URL: https://www.te.com/usa-en/product-1825159-1.html?te_bu=Cor&te_type=disp&te_campaign=seda_glo_cor-seda-global-disp-prtnr-fy19-seda-model-bom-cta_sma-317_1&elqCampaignId=32493; EU_RoHS_Compliance: Compliant; Switch_Type: Slide; SnapEDA_Link: https://www.snapeda.com/parts/1825159-1/TE%20Connectivity%20ALCOSWITCH%20Switches/view-part/?ref=snap; Value: *
SW4-SW6 = 1825910-6: ALCOSWITCH - TE CONNECTIVITY - 1825910-6 - TACT SWITCH, SPST, 0.05A, 24VDC, SOLDER; Manufacturer: TE Connectivity Alcoswitch; Actuator Material: PBT; Mechanical Life: 100000Cycles; Operating Force: 160gf; Illumination Type: Non-Illuminated,Illuminated; Switch Travel: 0.25mm; Switch Function: Off-Mom; Actuator Type: Standard; Max Voltage Rating (DC): 24V; Contact Current Rating: 50mA; Contact Resistance: 100mR; Actuator Length: 0.055inch; Supplier 1: Digi-Key; Manufacturer Part Number: 1825910-6; Stock 1: 40831; Pricing 1: 1=0.1, 10=0.101, 25=0.0976, 50=0.094, 100=0.0888, 250=0.08352, 500=0.08006, 1000=0.06091, 5000=0.05047 (USD); Mount: Through Hole; Contact Material: Copper Alloy; Contact Plating: Silver; Min Operating Temperature: -35°C; Max Operating Temperature: 85°C; Termination: PC Pins; Throw Configuration: SPST; Package Quantity: 750; Packaging: Loose Piece; Orientation: Straight; Electrical Life: 100000Cycles; Type: Switch; Max Current Rating: 50mA; Length: 5.99mm; REACH SVHC: Unknown; ELV: Compliant; Lead Free: Lead Free; ComponentLink1URL: http://www.onlinecomponents.com/productFiles/mf-AMP/1825910-6rqpn1825910-6.pdf?src-supplier=Onlinecomponents.com; ComponentLink1Description: http://www.onlinecomponents.com/productFiles/mf-AMP/1825910-6rqpn1825910-6.pdf?src-supplier=Onlinecomponents.com; ComponentLink2URL: http://www.te.com/commerce/DocumentDelivery/DDEController?Action=srchrtrv&DocNm=1825910&DocType=Customer+Drawing&DocLang=English&src-supplier=Verical; ComponentLink2Description: http://www.te.com/commerce/DocumentDelivery/DDEController?Action=srchrtrv&DocNm=1825910&DocType=Customer+Drawing&DocLang=English&src-supplier=Verical; Supplier Part Number 1: 450-1650-ND
U1 = LM1117T-3.3/NOPB: TEXAS INSTRUMENTS         LM1117T-3.3/NOPB            IC, LDO VOLT REG, 0.8A, 3.3V, TO220-3; Manufacturer: TI National Semiconductor; Max Input Voltage: 15V; Output Current: 800mA; Number of Outputs: 1; Polarity: Positive; Quiescent Current: 10mA; Accuracy: 1%; Output Type: Fixed; Dropout Voltage: 1.2V; Current Rating: 800A; Supplier 1: Digi-Key; Manufacturer Part Number: LM1117T-3.3/NOPB; Stock 1: 2187; Pricing 1: 1=1.54, 10=1.381, 25=1.3104, 100=1.0764, 500=0.8892, 1000=0.702, 2500=0.6552, 5000=0.62244 (USD); Mount: Through Hole; Case/Package: TO-220; Number of Pins: 3; Weight: 0.01lb; Contact Plating: Tin,Matte; Min Operating Temperature: -40°C; Max Operating Temperature: 125°C; Package Quantity: 45; Output Voltage: 3.3V; Packaging: Rail/Tube; Max Output Current: 800mA; Nominal Output Voltage: 3.3V; Output Voltage Accuracy: 1%; Length: 10.16mm; Height: 8.89mm; Width: 4.7mm; Radiation Hardening: No; Lead Free: Lead Free; REACH SVHC: No SVHC; ComponentLink1URL: http://www.farnell.com/datasheets/2019100.pdf?src-supplier=Element14; ComponentLink1Description: http://www.farnell.com/datasheets/2019100.pdf?src-supplier=Element14; ComponentLink2URL: http://www.ti.com/lit/ds/symlink/lm1117.pdf?src-supplier=Digi-Key; ComponentLink2Description: http://www.ti.com/lit/ds/symlink/lm1117.pdf?src-supplier=Digi-Key; ComponentLink3URL: https://www.verical.com/server-webapp/html/getDatasheet?partID=67377&src-supplier=Verical; ComponentLink3Description: https://www.verical.com/server-webapp/html/getDatasheet?partID=67377&src-supplier=Verical; ComponentLink4URL: https://www.distrelec.biz/Web/Downloads/7t/_e/iaLM1117T_e.pdf?mime=application%2Fpdf&src-supplier=Distrelec; ComponentLink4Description: https://www.distrelec.biz/Web/Downloads/7t/_e/iaLM1117T_e.pdf?mime=application%2Fpdf&src-supplier=Distrelec; ComponentLink5URL: http://www.jameco.com/Jameco/Products/ProdDS/242115.pdf?src-supplier=Jameco; ComponentLink5Description: http://www.jameco.com/Jameco/Products/ProdDS/242115.pdf?src-supplier=Jameco; ComponentLink6URL: http://www.produktinfo.conrad.com/datenblaetter/1000000-1099999/001013630-da-01-en-IC_REG_LDO_LM1117T_3_3_NOPB_TO_220_3_TID.pdf?src-supplier=Conrad; ComponentLink6Description: http://www.produktinfo.conrad.com/datenblaetter/1000000-1099999/001013630-da-01-en-IC_REG_LDO_LM1117T_3_3_NOPB_TO_220_3_TID.pdf?src-supplier=Conrad; ComponentLink7URL: http://datasheet.iiic.cc/national_semiconductor/LM1117T-3.3_NOPB.pdf?src-supplier=IIIC; ComponentLink7Description: http://datasheet.iiic.cc/national_semiconductor/LM1117T-3.3_NOPB.pdf?src-supplier=IIIC; Supplier Part Number 1: LM1117T-3.3/NOPB-ND
U2 U4 = CAT28C16ALI-20: Integrated Circuit; Manufacturer_Name: ON Semiconductor; Manufacturer_Part_Number: CAT28C16ALI-20
U6 = EPM1270T144C5N: MAX II 3.3/2.5V CPLD, 116 IOs, 1,270 Logic Elements, 144-Pin Plastic TQFP, Commercial Temperature, Speed Grade 5, Pb-Free; Note1: Each set of VCCIO pins can be connected to 3.3V, 2.5V, 1.8V, or 1.5V.; Note2: All VCCINT pins must be connected to either 3.3V or 2.5V (but not a combination of both).; DatasheetVersion: ver1.8, Jul-2006; Code_JEDEC: MS-026-BFB; PackageVersion: ver15.4, Dec-2008; PackageDescription: 144-Pin Plastic Thin Quad Flat Pack (TQFP144) - Wire Bond; PackageReference: TQFP144; PartNumber: EPM1270T144C5N
U7-U10 = SC52-11HWA: Display: LED; single 7-segment; 13.2mm; red; 0.9-2.2mcd; MF: Kingbright; Package: None; MP: SC52-11HWA; Price: None; Availability: Unavailable; SnapEDA_Link: https://www.snapeda.com/parts/SC52-11HWA/Kingbright/view-part/?ref=snap; Value: *
Y1 = ECS-TXO-5032-120-TR: ECS-TXO-5032, OSC TCXO 12.000MHZ HCMOS SMD, 3.3V, 2.5ppm, -30C ~ 85C, 6mA, Surface Mount, 0.197 L x 0.126 W _5.00mm...; MF: ECS Inc.; Digi-Key_Purchase_URL: *; Package: SMD-4 ECS International; SnapEDA_Link: https://www.snapeda.com/parts/ECS-TXO-5032-120-TR/ECS%20Inc./view-part/?ref=snap; Digi-Key_Part_Number: *; MP: ECS-TXO-5032-120-TR; Value: *